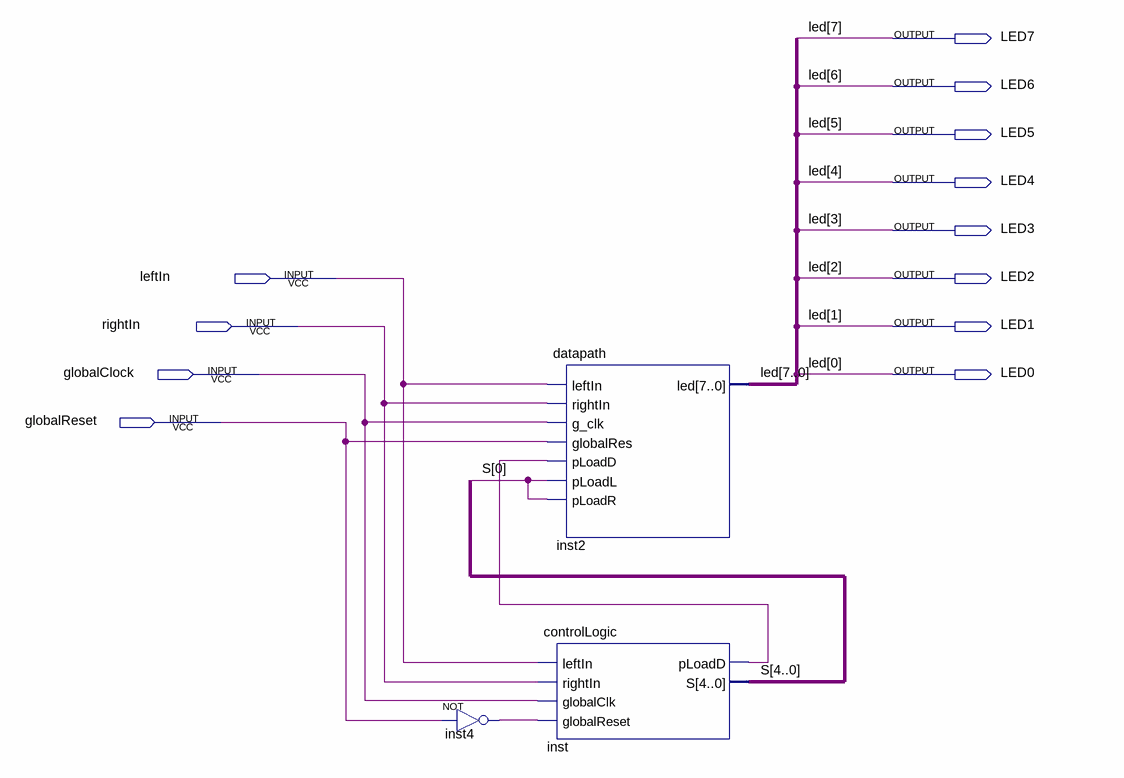
[diagram p0: schematic sheet]
// Quartus schematic top.bdf as structural Verilog: 3 symbols, 12 pins
module top (
  input  leftIn,
  input  rightIn,
  input  globalClock,
  input  globalReset,
  output LED7,
  output LED6,
  output LED5,
  output LED4,
  output LED3,
  output LED2,
  output LED1,
  output LED0
);

  wire inst4_out, inst_ploadd;
  wire [4:0] S;

  not inst4 (inst4_out, globalReset);
  datapath inst2 (
    .leftIn(leftIn), .rightIn(rightIn), .g_clk(globalClock), .globalRes(globalReset), .pLoadD(inst_ploadd),
    .pLoadL(S[0]), .pLoadR(S[0]), .led({LED7, LED6, LED5, LED4, LED3, LED2, LED1, LED0}));
  controlLogic inst (
    .leftIn(leftIn), .rightIn(rightIn), .globalClk(globalClock), .globalReset(inst4_out),
    .pLoadD(inst_ploadd), .S(S));
endmodule
